# Altium schematic sheet Top Sheet.SchDoc
size A4; PageSetup: Record=PageOptions|CenterHorizontal=True|CenterVertical=True|PrintScale=1.00|XCorrection=1.00|YCorrection=1.00|PrintKind=1|BorderSize=5000000|LeftOffset=0|BottomOffset=0|Orientation=2|PaperLength=1000|PaperWidth=1000|Scale=100|PaperSource=7|PrintQuality=-3|MediaType=1|DitherType=10|PrintScaleMode=1|PaperKind=11x17|PaperIndex=3
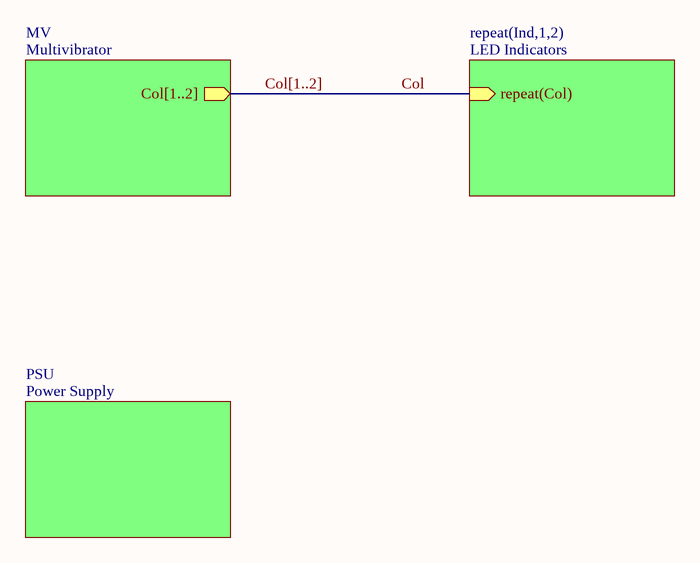
[diagram p0: Top Sheet.SchDoc]

## Sub-sheets
MV = Multivibrator: Col[1..2] (out)
PSU = Power Supply: no entries
repeat(Ind,1,2) = LED Indicators: repeat(Col) (in)

## Nets
Col: sheet repeat(Ind,1,2)/repeat(Col)

## Buses and harness runs
bus Col[1..2] = sheet MV/Col[1..2]